# EAGLE design jkw_hdmi_v2 (EAGLE 7.6.0)
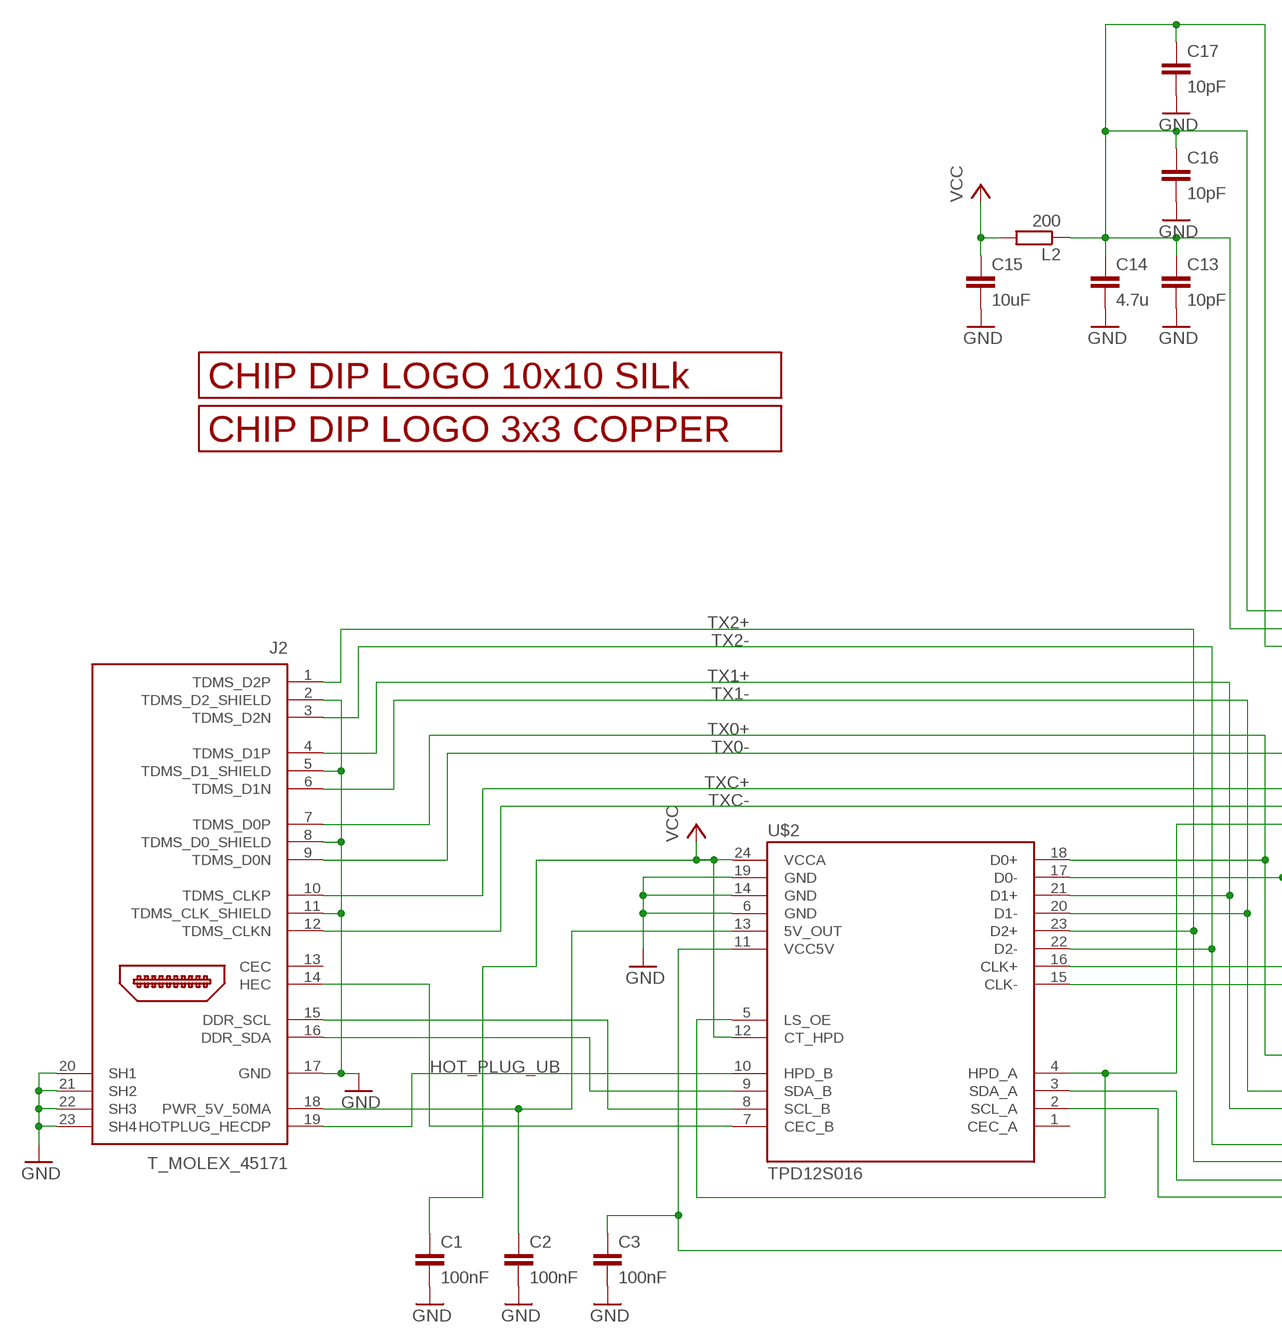
[diagram p0: schematic, sheet 1, part 1 of 2]
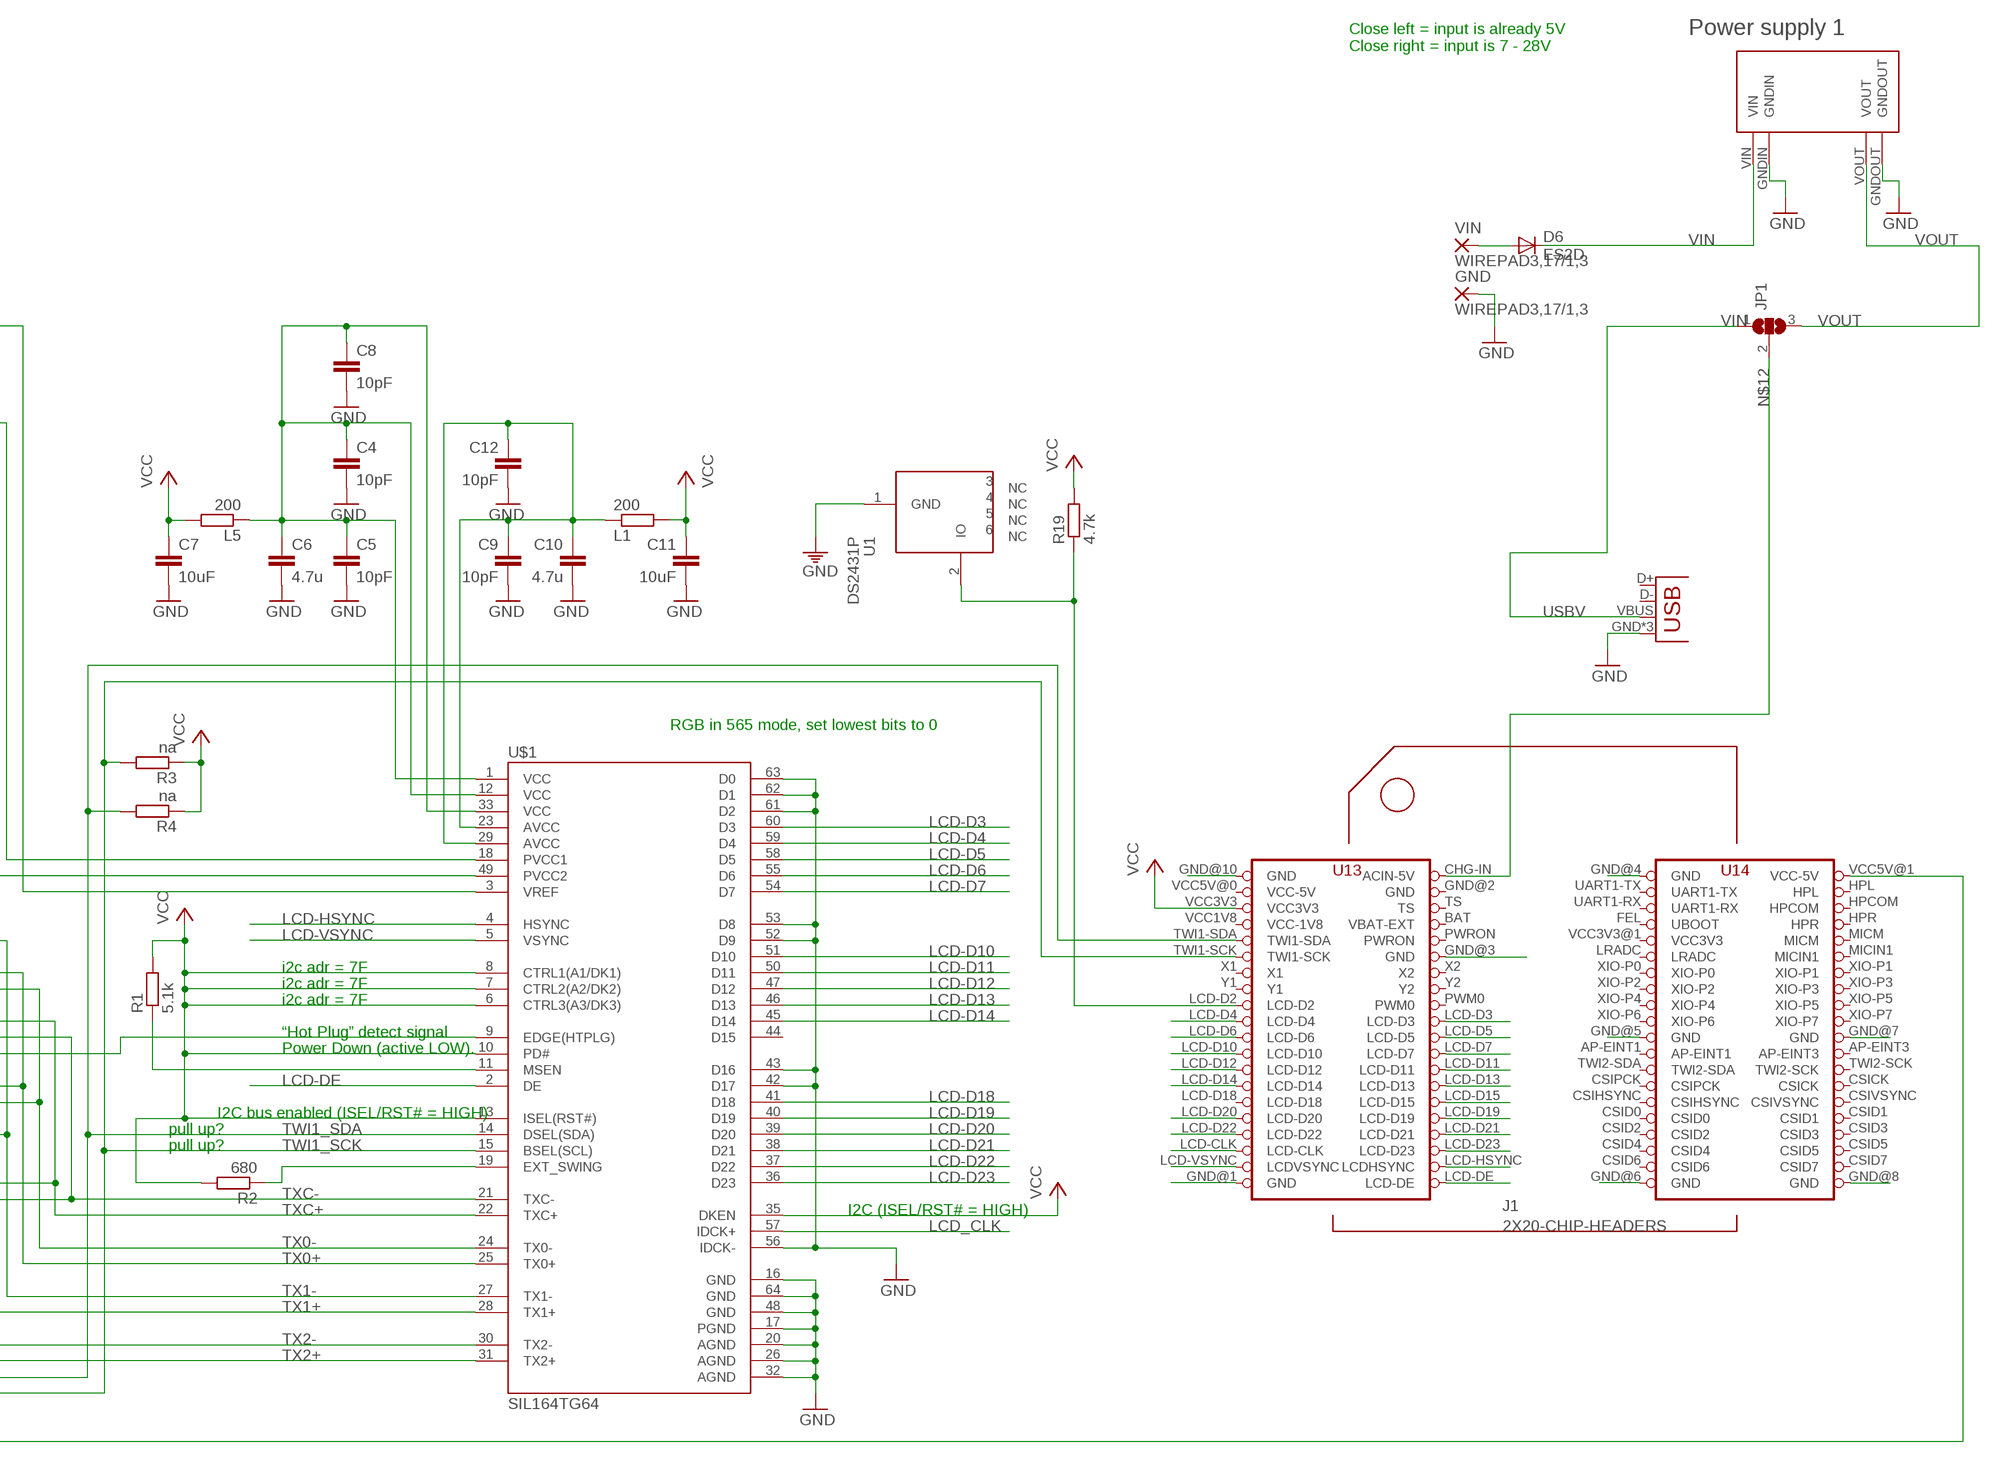
[diagram p1: schematic, sheet 1, part 2 of 2]

## Parts
C1  100nF  C-EUC0805  [C0805]
C2  100nF  C-EUC0805  [C0805]
C3  100nF  C-EUC0805  [C0805]
C4  10pF  C-EUC0805  [C0805]
C5  10pF  C-EUC0805  [C0805]
C6  4.7u  C-EUC0805  [C0805]
C7  10uF  C-EUC0805  [C0805]
C8  10pF  C-EUC0805  [C0805]
C9  10pF  C-EUC0805  [C0805]
C10  4.7u  C-EUC0805  [C0805]
C11  10uF  C-EUC0805  [C0805]
C12  10pF  C-EUC0805  [C0805]
C13  10pF  C-EUC0805  [C0805]
C14  4.7u  C-EUC0805  [C0805]
C15  10uF  C-EUC0805  [C0805]
C16  10pF  C-EUC0805  [C0805]
C17  10pF  C-EUC0805  [C0805]
D6  ES2D  [SMB]
GND  WIREPAD3,17/1,3  [3,17/1,3]
J1  2X20-CHIP-HEADERS  [2X20CHIP_SM]
J2  T_MOLEX_45171  [T_MOLEX_45171]
JP1  SJ2W  [SJ_2]
L1  200  R-EU_R0805  [R0805]
L2  200  R-EU_R0805  [R0805]
L5  200  R-EU_R0805  [R0805]
POWER_USB  USBUSB-MICROB-SMT-DIP  [USB-MICROB-SMT-DIP]
R1  5.1k  R-EU_M0805  [M0805]
R2  680  R-EU_M0805  [M0805]
R3  na  R-EU_M0805  [M0805]
R4  na  R-EU_M0805  [M0805]
R19  4.7k  R-EU_R0805  [R0805]
U1  DS2431P  [TSOC6]
U$1  SIL164TG64  [TQFP64]
U$2  TPD12S016  [DIL24]
U$3  LOGO_10X10_SILK  [LOGO_10X10_SILK]
U$4  LOGO_3X3_COPPER  [LOGO_3X3_COPPER]
U$9  MP1584EN_FRAMELESS  [MP1584EN_FRAMELESS]
VIN  WIREPAD3,17/1,3  [3,17/1,3]

## Nets
ASD: R1.1 U$1.11(MSEN)
GND: C1.2 C2.2 C3.2 C4.2 C5.2 C6.2 C7.2 C8.2 C9.2 C10.2 C11.2 C12.2 C13.2 C14.2 C15.2 C16.2 C17.2 GND.1(P) J1.GND@1(GND) J1.GND@3(GND) J1.GND@4(GND) J1.GND@5(GND) J1.GND@6(GND) J1.GND@7(GND) J1.GND@8(GND) J1.GND@10(GND) J2.2(TDMS_D2_SHIELD) J2.5(TDMS_D1_SHIELD) J2.8(TDMS_D0_SHIELD) J2.11(TDMS_CLK_SHIELD) J2.17(GND) J2.20(SH1) J2.21(SH2) J2.22(SH3) J2.23(SH4) POWER_USB.GND POWER_USB.MT1(GND) POWER_USB.MT2(GND) U1.1(GND) U$1.16(GND) U$1.17(PGND) U$1.20(AGND) U$1.26(AGND) U$1.32(AGND) U$1.42(D17) U$1.43(D16) U$1.48(GND) U$1.52(D9) U$1.53(D8) U$1.56(IDCK-) U$1.61(D2) U$1.62(D1) U$1.63(D0) U$1.64(GND) U$2.6(GND) U$2.14(GND) U$2.19(GND) U$9.GNDIN U$9.GNDOUT
HOT_PLUG_UB: J2.19(HOTPLUG_HECDP) U$2.10(HPD_B)
HOTPLUG_DET: U$1.9(EDGE(HTPLG)) U$2.4(HPD_A) U$2.5(LS_OE)
LCD-D3: J1.LCD-D3 U$1.60(D3)
LCD-D4: J1.LCD-D4 U$1.59(D4)
LCD-D5: J1.LCD-D5 U$1.58(D5)
LCD-D6: J1.LCD-D6 U$1.55(D6)
LCD-D7: J1.LCD-D7 U$1.54(D7)
LCD-D10: J1.LCD-D10 U$1.51(D10)
LCD-D11: J1.LCD-D11 U$1.50(D11)
LCD-D12: J1.LCD-D12 U$1.47(D12)
LCD-D13: J1.LCD-D13 U$1.46(D13)
LCD-D14: J1.LCD-D14 U$1.45(D14)
LCD-D15: J1.LCD-D15
LCD-D18: U$1.41(D18)
LCD-D19: J1.LCD-D19 U$1.40(D19)
LCD-D20: J1.LCD-D20 U$1.39(D20)
LCD-D21: J1.LCD-D21 U$1.38(D21)
LCD-D22: J1.LCD-D22 U$1.37(D22)
LCD-D23: J1.LCD-D23 U$1.36(D23)
LCD-DE: J1.LCD-DE U$1.2(DE)
LCD-HSYNC: J1.LCD-HSYNC(LCDHSYNC) U$1.4(HSYNC)
LCD-VSYNC: J1.LCD-VSYNC(LCDVSYNC) U$1.5(VSYNC)
LCD_CLK: J1.LCD-CLK U$1.57(IDCK+)
N$2: R2.1 U$1.19(EXT_SWING)
N$3: C2.1 J2.18(PWR_5V_50MA) U$2.13(5V_OUT)
N$4: C4.1 C5.1 C6.1 C8.1 L5.1 U$1.1(VCC) U$1.12(VCC) U$1.33(VCC)
N$5: J1.LCD-D2 R19.1 U1.2(IO)
N$6: J2.15(DDR_SCL) U$2.8(SCL_B)
N$7: J2.16(DDR_SDA) U$2.9(SDA_B)
N$8: C9.1 C10.1 C12.1 L1.1 U$1.23(AVCC) U$1.29(AVCC)
N$9: J2.14(HEC) U$2.7(CEC_B)
N$10: C13.1 C14.1 C16.1 C17.1 L2.1 U$1.3(VREF) U$1.18(PVCC1) U$1.49(PVCC2)
N$12: J1.CHG-IN(ACIN-5V) JP1.2
N$65: D6.A VIN.1(P)
TWI1_SCK: J1.TWI1-SCK R3.2 U$1.15(BSEL(SCL)) U$2.2(SCL_A)
TWI1_SDA: J1.TWI1-SDA R4.2 U$1.14(DSEL(SDA)) U$2.3(SDA_A)
TX0+: J2.7(TDMS_D0P) U$1.25(TX0+) U$2.18(D0+)
TX0-: J2.9(TDMS_D0N) U$1.24(TX0-) U$2.17(D0-)
TX1+: J2.4(TDMS_D1P) U$1.28(TX1+) U$2.21(D1+)
TX1-: J2.6(TDMS_D1N) U$1.27(TX1-) U$2.20(D1-)
TX2+: J2.1(TDMS_D2P) U$1.31(TX2+) U$2.23(D2+)
TX2-: J2.3(TDMS_D2N) U$1.30(TX2-) U$2.22(D2-)
TXC+: J2.10(TDMS_CLKP) U$1.22(TXC+) U$2.16(CLK+)
TXC-: J2.12(TDMS_CLKN) U$1.21(TXC-) U$2.15(CLK-)
USBV: JP1.1 POWER_USB.VBUS
VCC: C1.1 C7.1 C11.1 C15.1 J1.VCC3V3 L1.2 L2.2 L5.2 R1.2 R2.2 R3.1 R4.1 R19.2 U$1.6(CTRL3(A3/DK3)) U$1.7(CTRL2(A2/DK2)) U$1.8(CTRL1(A1/DK1)) U$1.10(PD#) U$1.13(ISEL(RST#)) U$1.35(DKEN) U$2.12(CT_HPD) U$2.24(VCCA)
VCC_5V_DCC: C3.1 J1.VCC5V@1(VCC-5V) U$2.11(VCC5V)
VIN: D6.C U$9.VIN
VOUT: JP1.3 U$9.VOUT
Unconnected: J1.AP-EINT1 J1.AP-EINT3 J1.BAT(VBAT-EXT) J1.CSICK J1.CSID0 J1.CSID1 J1.CSID2 J1.CSID3 J1.CSID4 J1.CSID5 J1.CSID6 J1.CSID7 J1.CSIHSYNC J1.CSIPCK J1.CSIVSYNC J1.FEL(UBOOT) J1.HPCOM J1.HPL J1.HPR J1.LCD-D18 J1.LRADC J1.MICIN1 J1.MICM J1.PWM0 J1.PWRON J1.TS J1.TWI2-SCK J1.TWI2-SDA J1.UART1-RX J1.UART1-TX J1.X1 J1.X2 J1.XIO-P0 J1.XIO-P1 J1.XIO-P2 J1.XIO-P3 J1.XIO-P4 J1.XIO-P5 J1.XIO-P6 J1.XIO-P7 J1.Y1 J1.Y2 J2.13(CEC) POWER_USB.D+ POWER_USB.D- U1.3(NC) U1.4(NC) U1.5(NC) U1.6(NC) U$2.1(CEC_A)

## Notes on the sheet
- Power supply 1
- Close left = input is already 5V
  Close right = input is 7 - 28V
- RGB in 565 mode, set lowest bits to 0
- i2c adr = 7F
- i2c adr = 7F
- i2c adr = 7F
- “Hot Plug” detect signal
- Power Down (active LOW).
- I2C bus enabled (ISEL/RST# = HIGH)
- pull up?
- pull up?
- I2C (ISEL/RST# = HIGH)

## Power pins joined to a net without a drawn wire
D15: U$1.44(D15)
GND: J1.GND@2(GND)
VCC3V3: J1.VCC3V3@1(VCC3V3)
VCC-1V8: J1.VCC1V8(VCC-1V8)
VCC-5V: J1.VCC5V@0(VCC-5V)

## Library data of the parts
C1-C17 = rcl:C-EU: CAPACITOR, European symbol
D6 = diode:ES2D: DIODE super fast rectifier, 2 A
GND VIN = wirepad:WIREPAD: Wire PAD connect wire on PCB
J1 = VGA-DIP:2X20-CHIP-HEADERS: Through hole layout with chip reference
J2 = CHIP_HDMI:T_MOLEX_45171
JP1 = jumper:SJ2W: SMD solder JUMPER
L1 L2 L5 R1-R4 R19 = rcl:R-EU_: RESISTOR, European symbol
POWER_USB = Spark:USB
U1 = VGA-DIP:DS2431: 1024-Bit EEPROM This chip provides a 4x256 Bit EEPROM, which can be programmed@5V. Write protection and OTP emulation are available, too. Author: Jan Kandziora <jjj@gmx.de>; DESCRIPTION: IC, 1024-Bit, 1-Wire EEPROM, TSOC6; FOOTPRINT: TSOC6; LINK: http://www.digikey.com/product-detail/en/DS2431P%2BT%26R/DS2431P%2BT%26RCT-ND/3647900; MFG: DIGIKEY; MFG_PN: DS2431P+T&RCT-ND; PART_TYPE: IC; PRICE: 0.98; VENDOR: MAXIM; VENDOR_PART_NUMBER: DS2431P+T&R
U$1 = SII164CTG64:SIL164TG64
U$2 = SII164CTG64:TPD12S016
U$3 = logo:LOGO_10X10_SILK
U$4 = JKW_CHIP:LOGO_3X3_COPPER
U$9 = JKW_CHIP:MP1584EN_FRAMELESS

## Board
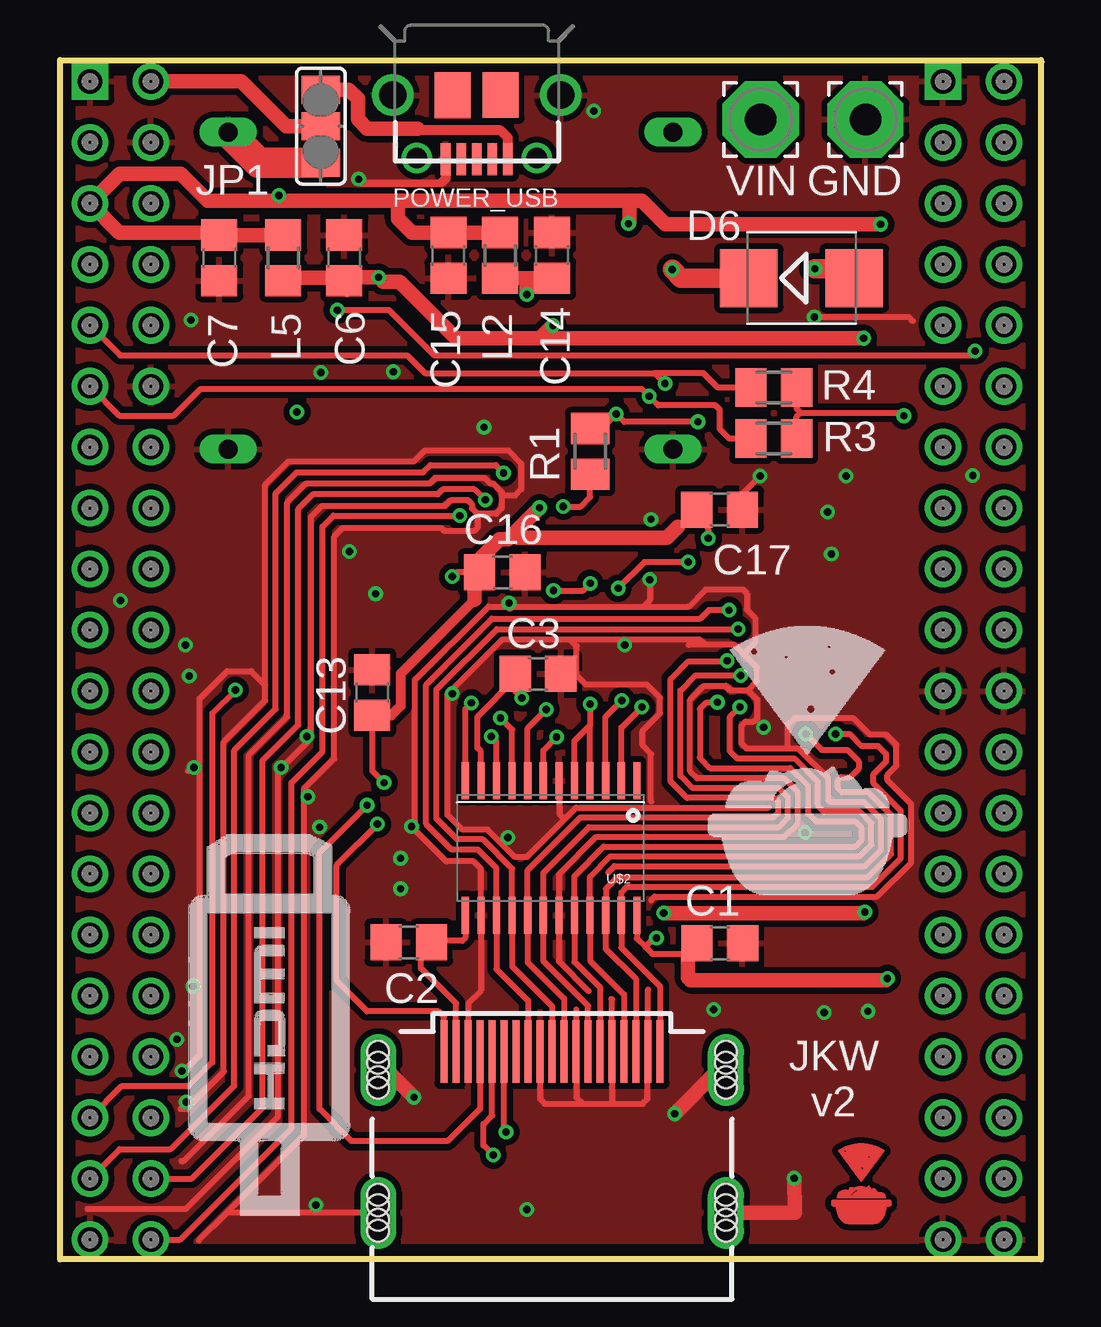
[diagram p2: board, top side]
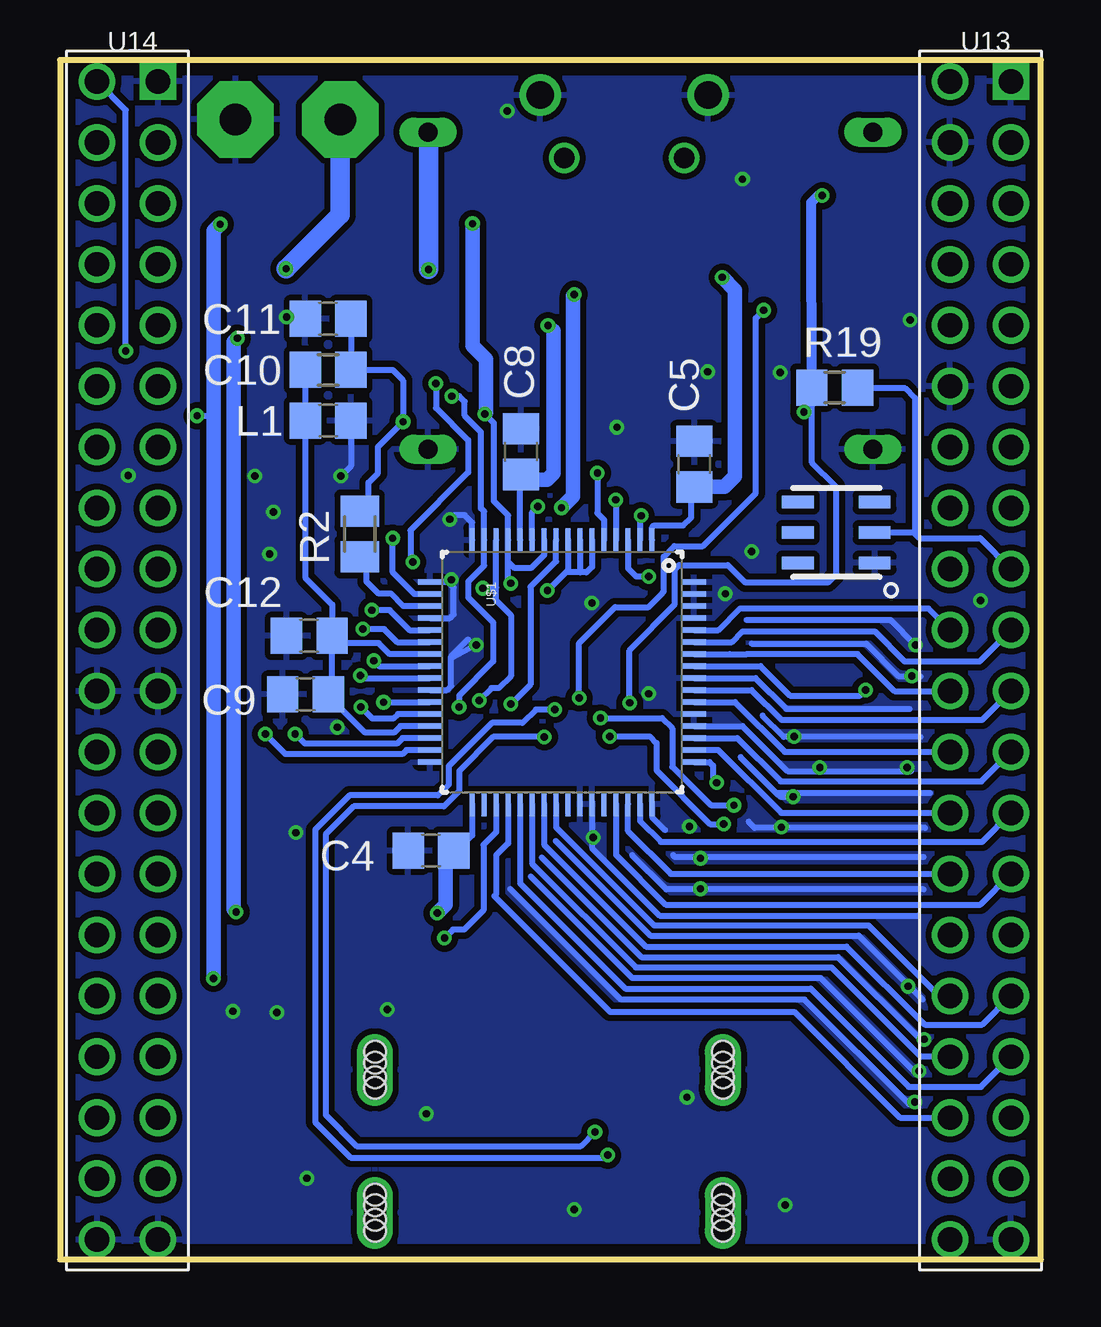
[diagram p3: board, bottom side, seen from below]

Size 40.89 x 49.97 mm. Coordinates in mm from the lower left corner, seen from the top.
Outline: 0,49.97 40.89,49.97 40.89,0 0,0 0,49.97
Copper layers (1*16): Top 0.035mm / dielectric 1.6mm / Bottom 0.035mm
Design rules "Elecrow_2-layer_PCB_eagle_rule": minimum track width 6mil, minimum drill 12mil, track to track 6mil, track to pad 6mil, pad to pad 6mil, via to via 8mil, smd to smd 0mil, copper to edge 20mil, drill to drill 10mil, minimum pad ring 6mil, minimum via ring 6mil, stop-mask expansion 0mil, vias tented up to drill 100mil, thermal gap 10mil

### Footprints (pad centres in the part's own frame; a part is rotated, then mirrored left to right if it is on the bottom)
C0805 = smd 1.3 x 1.5: 1 -0.95,0; 2 0.95,0
SMB = smd 2.4 x 2.4: A 2.2,0; C -2.2,0
3,17/1,3 = drill 1.321 pad 3.175 octagon: 1 0,0
2X20CHIP_SM = drill 1.016: AP-EINT1 36.81,21.65; AP-EINT3 39.35,21.65; BAT 3.79,41.97; CHG-IN 3.79,49.59; CSICK 39.35,16.57; CSID0 36.81,11.49; CSID1 39.35,11.49; CSID2 36.81,8.95; CSID3 39.35,8.95; CSID4 36.81,6.41; CSID5 39.35,6.41; CSID6 36.81,3.87; CSID7 39.35,3.87; CSIHSYNC 36.81,14.03; CSIPCK 36.81,16.57; CSIVSYNC 39.35,14.03; FEL 36.81,41.97; GND@1 3.79,36.89; GND@2 1.25,1.33; GND@4 39.35,24.19; GND@5 39.35,1.33; GND@6 36.81,1.33; GND@7 36.81,24.19; GND@10 3.79,47.05; HPCOM 39.35,44.51; HPL 39.35,47.05; HPR 39.35,41.97; LCD-CLK 1.25,6.41; LCD-D2 1.25,29.27; LCD-D3 3.79,26.73; LCD-D4 1.25,26.73; LCD-D5 3.79,24.19; LCD-D6 1.25,24.19; LCD-D7 3.79,21.65; LCD-D10 1.25,21.65; LCD-D11 3.79,19.11; LCD-D12 1.25,19.11; LCD-D13 3.79,16.57; LCD-D14 1.25,16.57; LCD-D15 3.79,14.03; LCD-D18 1.25,14.03; LCD-D19 3.79,11.49; LCD-D20 1.25,11.49; LCD-D21 3.79,8.95; LCD-D22 1.25,8.95; LCD-D23 3.79,6.41; LCD-DE 3.79,1.33; LCD-HSYNC 3.79,3.87; LCD-VSYNC 1.25,3.87; LRADC 36.81,36.89; MICIN1 39.35,36.89; MICM 39.35,39.43; PWM0 3.79,29.27; PWRON 3.79,39.43; TS 3.79,44.51; TWI1-SCK 1.25,36.89; TWI1-SDA 1.25,39.43; TWI2-SCK 39.35,19.11; TWI2-SDA 36.81,19.11; UART1-RX 36.81,44.51; UART1-TX 36.81,47.05; VCC1V8 1.25,41.97; VCC3V3 1.25,44.51; VCC3V3@1 36.81,39.43; VCC5V@0 1.25,47.05; VCC5V@1 39.35,49.59; X1 1.25,34.35; X2 3.79,34.35; XIO-P0 36.81,34.35; XIO-P1 39.35,34.35; XIO-P2 36.81,31.81; XIO-P3 39.35,31.81; XIO-P4 36.81,29.27; XIO-P5 39.35,29.27; XIO-P6 36.81,26.73; XIO-P7 39.35,26.73; Y1 1.25,31.81; Y2 3.79,31.81 | drill 1.016 square: GND@3 1.25,49.59; GND@8 36.81,49.59
T_MOLEX_45171 = smd 0.3 x 2.6: 1 4.5,10.31; 2 4,10.31; 3 3.5,10.31; 4 3,10.31; 5 2.5,10.31; 6 2,10.31; 7 1.5,10.31; 8 1,10.31; 9 0.5,10.31; 10 0,10.31; 11 -0.5,10.31; 12 -1,10.31; 13 -1.5,10.31; 14 -2,10.31; 15 -2.5,10.31; 16 -3,10.31; 17 -3.5,10.31; 18 -4,10.31; 19 -4.5,10.31 | drill 0.9 pad 1.499 long: 20 -7.25,3.59; 21 7.25,3.59; 22 7.25,9.55; 23 -7.25,9.55 | hole 0.9: -7.25,10.3; -7.25,8.8; -7.25,9.85; -7.25,9.25; -7.25,4.35; -7.25,2.85; -7.25,3.9; -7.25,3.3; 7.25,10.3; 7.25,8.8; 7.25,9.85; 7.25,9.25; 7.25,4.35; 7.25,3.9; 7.25,2.85; 7.25,3.3
SJ_2 = smd 1.168 x 1.6: 1 -1.524,0; 2 0,0; 3 1.524,0
R0805 = smd 1.3 x 1.5: 1 -0.95,0; 2 0.95,0
USB-MICROB-SMT-DIP = smd 0.4 x 1.35: D+ 0,2.675; D- -0.65,2.675; GND 1.3,2.675; ID 0.65,2.675; VBUS -1.3,2.675 | drill 1.15 pad 1.7: MT1 -3.5,0; MT2 3.5,0 | drill 0.85 pad 1.25: MT3 -2.5,2.625; MT4 2.5,2.625 | smd 1.5 x 1.9: P$1 -1,0; P$2 1,0.01
M0805 = smd 1.3 x 1.6: 1 -0.95,0; 2 0.95,0
TSOC6 = smd 0.53 x 1.33: 1 -1.27,-1.6; 2 0,-1.6; 3 1.27,-1.6; 4 1.27,1.6; 5 0,1.6; 6 -1.27,1.6
TQFP64 = smd 1 x 0.22: 1 -5.5,3.75; 2 -5.5,3.25; 3 -5.5,2.75; 4 -5.5,2.25; 5 -5.5,1.75; 6 -5.5,1.25; 7 -5.5,0.75; 8 -5.5,0.25; 9 -5.5,-0.25; 10 -5.5,-0.75; 11 -5.5,-1.25; 12 -5.5,-1.75; 13 -5.5,-2.25; 14 -5.5,-2.75; 15 -5.5,-3.25; 16 -5.5,-3.75; 33 5.5,-3.75; 34 5.5,-3.25; 35 5.5,-2.75; 36 5.5,-2.25; 37 5.5,-1.75; 38 5.5,-1.25; 39 5.5,-0.75; 40 5.5,-0.25; 41 5.5,0.25; 42 5.5,0.75; 43 5.5,1.25; 44 5.5,1.75; 45 5.5,2.25; 46 5.5,2.75; 47 5.5,3.25; 48 5.5,3.75 | smd 0.22 x 1: 17 -3.75,-5.5; 18 -3.25,-5.5; 19 -2.75,-5.5; 20 -2.25,-5.5; 21 -1.75,-5.5; 22 -1.25,-5.5; 23 -0.75,-5.5; 24 -0.25,-5.5; 25 0.25,-5.5; 26 0.75,-5.5; 27 1.25,-5.5; 28 1.75,-5.5; 29 2.25,-5.5; 30 2.75,-5.5; 31 3.25,-5.5; 32 3.75,-5.5; 49 3.75,5.5; 50 3.25,5.5; 51 2.75,5.5; 52 2.25,5.5; 53 1.75,5.5; 54 1.25,5.5; 55 0.75,5.5; 56 0.25,5.5; 57 -0.25,5.5; 58 -0.75,5.5; 59 -1.25,5.5; 60 -1.75,5.5; 61 -2.25,5.5; 62 -2.75,5.5; 63 -3.25,5.5; 64 -3.75,5.5
DIL24 = smd 0.3 x 1.55: 1 -3.6,-2.8; 2 -2.95,-2.8; 3 -2.3,-2.8; 4 -1.65,-2.8; 5 -1,-2.8; 6 -0.35,-2.8; 7 0.3,-2.8; 8 0.95,-2.8; 9 1.6,-2.8; 10 2.25,-2.8; 11 2.9,-2.8; 12 3.55,-2.8; 13 3.55,2.8; 14 2.9,2.8; 15 2.25,2.8; 16 1.6,2.8; 17 0.95,2.8; 18 0.3,2.8; 19 -0.35,2.8; 20 -1,2.8; 21 -1.65,2.8; 22 -2.3,2.8; 23 -2.95,2.8; 24 -3.6,2.8
MP1584EN_FRAMELESS = drill 0.8 long: GNDIN 1.778,14.986; GNDOUT 20.32,14.986; VIN 1.778,1.778; VOUT 20.32,1.778

### Placement (x,y rotation side)
C1  27.51,13.17 0 top
C2  14.54,13.21 180 top
C3  19.93,24.4 0 top
C4  25.43,17.03 180 bottom
C5  14.45,33.13 90 bottom
C6  11.85,41.73 90 top
C7  6.64,41.73 270 top
C8  21.68,33.66 90 bottom
C9  30.66,23.55 180 bottom
C10  29.72,34.95 0 bottom
C11  29.72,39.19 180 bottom
C12  30.51,25.98 180 bottom
C13  13.02,23.62 90 top
C14  20.51,41.83 90 top
C15  16.19,41.83 270 top
C16  18.44,28.63 0 top
C17  27.5,31.24 0 top
D6  30.91,40.88 0 top
GND  33.58,47.5 180 top
J1  0,-0.51 0 top
J2  20.51,-1.65 0 top
JP1  10.87,47.22 270 top
L1  29.72,37.06 0 bottom
L2  18.35,41.83 90 top
L5  9.31,41.73 90 top
POWER_USB  17.37,48.51 180 top
R1  22.1,33.67 90 top
R2  28.4,30.23 90 bottom
R3  29.76,34.2 180 top
R4  29.76,36.32 180 top
R19  8.6,36.32 180 bottom
U1  8.53,30.29 90 bottom
U$1  19.96,24.47 270 bottom
U$2  20.45,17.15 180 top
U$3  26.99,15.15 0 top
U$4  33.4,3.15 0 top
U$9  27.33,48.74 180 top
VIN  29.21,47.5 180 top

### Tracks (layer width: path | path; a pad name or v marks a point on that pad's centre or on a via)
ASD  (via drill 0.3)
  Top 0.254: 22.17,32.39 R1.1 22.1,31.78 21.69,31.37 v20.98,31.37
  Bottom 0.254: U$1.11 21.21,31.14 v20.98,31.37
GND  (via drill 0.3)
  Top 0.254: 24.51,11.24 J2.2 24.49,8.63 24.49,6.68 24.28,6.48 22.96,6.48 | J2.8 21.53,8.68 | 21.53,8.68 21.53,10.41 | 22.99,10.86 23.01,10.84 J2.5 23.01,6.53 22.96,6.48 | 22.04,11.18 20.8,12.41 U$2.19 20.8,16.05 22.35,17.6 30.2,17.6 30.76,18.16 30.76,19.48 30.2,20.04 26.57,20.04 26.26,20.34 26.26,23.32 26.85,23.9 27.74,23.9 | U$2.6 20.83,19.91 20.83,18.54 21.03,18.34 | 27.94,8.08 J2.22 | J2.17 17.02,10.67 17.55,11.2 U$2.14 17.55,16.29 17.25,16.59 16.1,16.59 14.81,17.88 14.81,24.16 17.86,27.2 18.75,27.2 24.33,27.2 | 28.68,23.72 29.08,23.32 29.08,22.55 28.93,22.4 28.58,22.4 28.4,22.23 28.4,21.51 28.63,21.29 30.33,21.29 | 27.97,23.72 27.79,23.9 27.74,23.9 | 27.74,23.9 27.91,23.72 27.97,23.72 | 27.97,23.72 28.68,23.72 | 28.68,23.72 29.06,24.1 29.06,24.66 28.49,25.23 | 26.21,25.6 28.12,25.6 28.49,25.23 | 21.03,18.34 21.51,18.82 29.54,18.82 | 21.03,18.34 19.46,16.76 18.97,16.76 17.83,17.91 16.77,17.91 16.15,18.53 16.15,23.55 18.44,25.83 26.67,25.83 26.85,25.65 26.85,25.68 | 24.33,27.2 26.21,27.2 26.92,27.91 28.47,27.91 28.63,27.76 28.63,27.08 28.98,26.72 28.98,25.73 28.49,25.23 | J2.20 6.94,1.94 | 6.94,1.94 5.79,0.79 | 6.94,1.94 10.18,5.18 10.18,19.61 11.43,20.85 11.43,30.12 11.79,30.48 15.88,30.48 16,30.35 17.27,30.35 17.4,30.48 17.4,31.06 | 5.03,6.27 5.28,6.27 6.83,7.82 6.83,21.56 8.56,23.29 8.56,23.93 | 8.56,23.93 8.56,32.28 9.52,33.25 14.76,33.25 15.21,33.71 18.69,33.71 19.23,33.17 19.23,32.08 18.97,31.83 18.41,31.83 | 4.93,7.95 5.26,7.95 5.82,8.51 5.82,23.37 6.96,24.51 7.98,24.51 8.56,23.93 | 5.05,4.09 5.16,4.09 7.87,6.81 7.87,21.01 9.47,22.61 9.47,31.55 10.26,32.33 15.42,32.33 15.65,32.56 17.7,32.56 17.93,32.33 18.06,32.33 18.41,31.98 18.41,31.83
  Top 0.254: 1.14,2.11 5.26,2.11 9.09,5.94 9.09,20.34 10.46,21.72 10.46,30.94 10.92,31.39 16.05,31.39 16.31,31.65 16.99,31.65 17.17,31.47 17.17,31.29 17.4,31.06 | J2.11 20.01,6.69 20.22,6.48 21.79,6.48 | 21.79,6.48 22.96,6.48 | 21.53,8.68 21.53,6.74 21.79,6.48 | 22.86,16.13 23.11,16.38 33.55,16.38 34.24,17.07 34.24,18.34 33.53,19.05 32.11,19.05 32.03,19.13 32.03,20.04 30.79,21.29 30.33,21.29 | 24.64,14.96 24.79,15.11 34.06,15.11 35.48,16.54 35.48,18.97 34.49,19.96 34.49,20.19 34.87,20.57 34.87,21.44 34.44,21.87 33.76,21.87 33.07,22.55 30.61,22.55 30.33,22.28 30.33,21.29 | 18.41,31.83 18.41,31.29 18.19,31.06 17.4,31.06 | v24.64,30.84 24.64,30.79 24.74,30.68 | v31.45,39.27 35.38,39.27 35.56,39.09 | v24.59,28.32 24.59,27.46 24.33,27.2 | v5.59,20.5 5.59,20.34 5.33,20.34 | 24.64,19.08 24.64,21.06 24.28,21.41 24.28,22.02 25.02,22.76 25.02,23.39 24.46,23.95 21.92,23.95 21.54,24.33 21.54,25.55 21.31,25.78 21.34,25.78 21.36,25.81 | C17.2 28.45,31.9 v29.19,32.64
  Top 0.305: 15.95,44.91 15.88,44.83 12.62,44.83 v12.45,45.01
  Top 0.406: v18.72,27.36 18.75,27.33 18.75,27.2 | POWER_USB.GND 16.07,45.03 15.95,44.91
  Top 0.61: J2.21 30.64,1.94 v30.61,3.38 | J2.23 13.62,7.9 v14.76,6.76 | J2.22 27.46,7.9 v25.63,6.07
  Bottom 0.254: U$1.48 16.21,18.42 15.67,17.88 | U$1.43 18.71,17.14 15.9,14.33 5.13,14.33 | U$1.52 12.44,22.22 10.57,20.34 5.44,20.34 | U$1.56 11.9,24.22 10.62,22.94 5.49,22.94 | 5.03,21.77 10.72,21.77 11.61,22.66 | U$1.16 23.71,30.7 24.03,31.01 24.46,31.01 v24.64,30.84 | U$1.20 24.64,26.72 24.49,26.87 24.49,27.99 24.72,28.22 | 24.72,28.22 U$1.17 | C11.2 31.37,39.19 v31.45,39.27 | 24.72,28.22 24.69,28.22 v24.59,28.32 | U$1.26 24.77,23.72 24.59,23.9 24.59,25.04 | 24.59,25.04 v23.55,25.6 | 5.18,6.48 5.51,6.48 9.86,10.82 17.5,10.82 22.12,15.44 | 4.93,7.8 5.26,7.8 9.2,11.74 17.04,11.74 21.26,15.95 | 20.8,16.74 16.66,12.6 8.46,12.6 5.03,9.17 v4.88,9.17 | 20.22,17.42 16.28,13.49 7.59,13.49 5.49,11.38 | 4.93,10.82 5.49,11.38 | 5.49,11.38 v5.54,11.38 | 4.9,15.42 15.62,15.42 17.04,16.84 | 4.9,16.76 15.27,16.76 15.34,16.84 | 4.83,17.98 11.94,17.98 12.19,18.24 | 4.62,19.43 11.02,19.43 | 11.02,19.43 12.52,20.93 | 11.02,19.43 10.87,19.28 v10.34,19.28 | 12.07,25.65 7.29,25.65 5.94,24.31 5.05,24.31 5.03,24.28 | 12.27,26.65 6.27,26.65 5.21,25.58 | 24.59,25.04 24.59,25.12 23.88,25.83 | 5.41,20.34 5.44,20.34 | 5.44,20.34 v5.59,20.5 | C10.2 28.77,33.06 v29.19,32.64
  other vias: 5.46,39.14 22.25,47.85 12.07,29.49 2.51,27.46 18.67,17.58 14.66,18.03 9.22,20.5 10.29,21.79 13.16,27.74 16.36,23.57 32,31.14 32.16,29.39 32.77,32.64 38.05,32.66 17.68,34.67 13.89,36.98 10.87,36.96 31.85,10.29 33.68,10.34 19.46,2.08 10.67,2.26 5.08,7.85 5.26,6.55 14.2,15.44 14.2,16.71 10.82,18.01 5.38,24.31 5.23,25.6 31.06,17.78 29.34,22.17 27.25,10.41
  pour Top (isolate 0.254): 0.13,0 40.89,0 40.89,50 0.13,50
  pour Bottom (isolate 0.254): 0.13,0 40.89,0 40.89,50 0.13,50
HOT_PLUG_UB  (via drill 0.3)
  Top 0.254: U$2.10 18.2,21.58 v17.98,21.79 | v13.23,18.14 11.53,16.43 11.53,11.61 12.8,10.34 15.77,10.34 16.01,10.1 J2.19
  Bottom 0.254: v17.98,21.79 16.31,21.79 16.03,21.51 16.03,20.37 13.79,18.14 v13.23,18.14
HOTPLUG_DET  (via drill 0.3)
  Top 0.254: U$2.4 22.1,22.25 | U$2.5 21.45,21.6 22.1,22.25 | v22.1,23.14 22.1,22.25
  Bottom 0.254: U$1.9 20.21,29.09 21.29,28.02 21.29,23.95 v22.1,23.14
LCD-D3
  Bottom 0.254: U$1.60 13.45,26.22 12.55,27.13 4.7,27.13 J1.LCD-D3
LCD-D4
  Bottom 0.254: U$1.59 12.89,25.72 12.45,26.16 6.93,26.16 5.69,24.92 2.55,24.92 J1.LCD-D4
LCD-D5
  Bottom 0.254: U$1.58 12.98,25.22 12.27,25.22 7.65,25.22 6.11,23.68 J1.LCD-D5
LCD-D6
  Bottom 0.254: U$1.55 12.06,23.72 10.82,22.48 2.45,22.48 J1.LCD-D6
LCD-D7
  Bottom 0.254: U$1.54 12.76,23.22 10.68,21.14 J1.LCD-D7
LCD-D10
  Bottom 0.254: U$1.51 12.66,21.72 10.85,19.91 2.48,19.91 J1.LCD-D10
LCD-D11
  Bottom 0.254: U$1.50 13.45,21.22 10.83,18.6 J1.LCD-D11
LCD-D12
  Bottom 0.254: U$1.47 16.71,18.26 15.85,17.4 2.45,17.4 J1.LCD-D12
LCD-D13
  Bottom 0.254: J1.LCD-D13 15.43,16.06 17.21,17.85 U$1.46
LCD-D14
  Bottom 0.254: U$1.45 17.71,16.85 15.65,14.78 2.53,14.78 J1.LCD-D14
LCD-D19
  Bottom 0.254: U$1.40 20.21,18.01 16.13,13.92 7.19,13.92 4.25,10.98 J1.LCD-D19
LCD-D20
  Bottom 0.254: U$1.39 20.71,17.29 16.46,13.03 8.1,13.03 4.85,9.78 2.45,9.78 J1.LCD-D20
LCD-D21
  Bottom 0.254: U$1.38 21.21,16.49 16.89,12.17 8.74,12.17 5.01,8.44 J1.LCD-D21
LCD-D22
  Bottom 0.254: U$1.37 21.71,15.67 17.32,11.28 9.6,11.28 5.51,7.19 2.5,7.19 J1.LCD-D22
LCD-D23
  Bottom 0.254: U$1.36 22.21,17.33 22.71,16.84 22.71,15.22 22.78,15.14 17.96,10.31 10.29,10.31 5.88,5.9 J1.LCD-D23
LCD-DE  (via drill 0.3)
  Top 0.254: J1.LCD-DE 5.01,0.82 9.65,5.46 9.65,19.86 10.95,21.16 10.95,30.53 11.41,30.99 v16.66,30.99
  Bottom 0.254: v16.66,30.99 16.71,30.94 U$1.2
LCD-HSYNC  (via drill 0.3)
  Top 0.254: J1.LCD-HSYNC 5.5,3.36 8.46,6.33 8.46,20.8 9.93,22.28 9.93,31.27 10.54,31.88 15.75,31.88 15.95,32.08 17.27,32.08 v17.73,31.65
  Bottom 0.254: v17.73,31.65 17.71,31.35 U$1.4
LCD-VSYNC  (via drill 0.3)
  Top 0.254: J1.LCD-VSYNC 2.48,4.6 4.62,4.6 7.26,7.24 7.26,21.21 8.99,22.94 8.99,31.93 9.86,32.79 15.14,32.79 15.44,33.1 18.16,33.1 v18.49,32.77
  Bottom 0.254: v18.49,32.77 18.49,31.09 18.21,30.81 U$1.5
LCD_CLK  (via drill 0.3)
  Top 0.254: J1.LCD-CLK 2.56,7.21 5.36,7.21 6.35,8.2 6.35,22.76 v7.32,23.72
  Bottom 0.254: U$1.57 11.69,24.72 10.46,23.49 7.54,23.49 v7.32,23.72
N$1
  Top 0.406: 10.82,47.19 10.82,48.57 10.87,48.62
N$2
  Bottom 0.254: U$1.19 26.59,27.22 27.1,27.74 27.61,27.74 28.12,28.25 28.12,29.15 R2.1
N$3
  Top 0.254: U$2.13 16.9,13.4 16.76,13.27 15.5,13.27 C2.1 15.05,13.21 15.05,12.13 16.51,10.67 J2.18
N$4  (via drill 0.3)
  Top 0.254: 9.44,40.91 L5.1 | 11.72,40.91 C6.1 11.96,40.67 11.96,40.41 | 33.5,14.43 v33.55,14.48 | 13.46,40.74 v13.28,40.92
  Top 0.61: 9.44,40.91 11.72,40.91 | v25.17,14.43 33.5,14.43 | v33.5,38.38 20.02,38.38 | 20.02,38.38 16.51,38.38 14.15,40.74 13.46,40.74 | v20.55,38.91 20.02,38.38 | 11.96,40.41 12.47,40.92 v13.28,40.92
  Bottom 0.254: U$1.1 16.21,30.5 16.13,30.58 14.91,30.58 14.58,30.91 14.58,32.06 C5.1 | U$1.33 23.71,17.66 24.82,16.56 24.82,16.69 C4.1 | C8.1 21.71,32.41 U$1.12 21.71,32.36 21.59,32.49 | 33.66,14.58 v33.55,14.48 | 20.32,38.68 v20.55,38.91
  Bottom 0.61: C5.1 13.21,32.18 12.75,32.64 12.75,40.39 v13.28,40.92 | 21.59,32.49 20.6,32.49 20.32,32.77 20.32,38.68 | 24.82,16.56 24.82,14.78 v25.17,14.43 | 33.66,14.58 33.66,38.23 v33.5,38.38
N$5
  Bottom 0.254: U1.2 5.32,30.29 5.26,30.23 | J1.LCD-D2 2.54,30.05 5.08,30.05 5.26,30.23 | 5.26,30.23 5.26,35.89 5.66,36.3 7.62,36.3 R19.1
N$6  (via drill 0.3)
  Top 0.254: U$2.8 19.5,22.14 v20.27,22.91 | v18.06,4.34 17.65,4.75 17.65,5.64 18.01,6 J2.15
  Bottom 0.254: v20.27,22.91 21.06,22.91 21.62,22.35 22.88,22.35 24.69,20.55 24.69,19.79 25.15,19.33 28.83,19.33 30.25,17.91 30.25,5.71 28.78,4.24 18.16,4.24 v18.06,4.34
N$7  (via drill 0.3)
  Top 0.254: U$2.9 18.85,22.07 v18.36,22.55 | v12.8,18.92 10.82,16.94 10.82,6.27 12.17,4.93 16.15,4.93 17.51,6.28 J2.16
  Bottom 0.254: v18.36,22.55 15.8,22.55 15.37,22.12 15.37,20.52 13.77,18.92 v12.8,18.92
N$8
  Bottom 0.254: U$1.23 27.15,25.22 27.61,25.68 29.25,25.68 C12.1 | U$1.29 26.7,22.22 26.98,21.95 28.17,21.95 29.71,23.48 C9.1 29.55,23.7 C12.1 | C12.1 29.85,25.69 29.87,25.71 | L1.1 C10.1 30.67,28.41 29.54,27.28 29.54,26 C12.1
N$9  (via drill 0.3)
  Top 0.254: U$2.7 20.15,21.21 v20.7,21.77 | v18.59,5.31 18.51,5.39 J2.14
  Bottom 0.254: v18.59,5.31 19.18,4.72 28.52,4.72 29.82,6.02 29.82,17.7 28.65,18.87 24.89,18.87 24.26,19.51 24.26,20.34 22.84,21.77 v20.7,21.77
N$10  (via drill 0.3)
  Top 0.254: C13.1 13.02,20.36 v13.51,19.86 | C16.1 16.54,28.63 v16.36,28.45 | 17.27,28.41 C16.1 | C16.1 17.49,29.17 | 18.67,30 18.91,30.24 19.07,30.07 | v27.03,30.05 27.03,30.41 C17.1 25.78,30.53 25.76,30.53
  Top 0.406: 17.27,27.48 14.2,24.41 14.2,23.06 13.81,22.67 C13.1
  Top 0.61: C14.1 19.46,40.88 | 19.46,40.88 L2.1 | 17.27,27.48 17.27,28.41 | 17.49,29.17 18.31,30 18.67,30 | 18.91,30.24 v19.99,31.32 | v19.46,40.21 19.46,40.88 | 19.07,30.07 25.3,30.07 25.76,30.53 | 13.11,22.58 C13.1
  Bottom 0.254: U$1.3 17.21,28.8 16.87,28.45 v16.36,28.45 | 13.56,19.86 v13.51,19.86 13.66,20.02 13.66,20.57 13.81,20.72 U$1.49 | U$1.18 26.12,27.72 27.03,28.63 v27.03,30.05
  Bottom 0.61: v19.99,31.32 19.51,31.8 19.51,40.16 v19.46,40.21
N$12
  Top 0.61: J1.CHG-IN 7.56,49.08 9.42,47.22 JP1.2
N$65  (via drill 0.3)
  Top 0.813: v31.47,41.28 32.58,41.28 D6.A
  Bottom 0.813: VIN.1 29.21,43.54 v31.47,41.28
TWI1_SCK  (via drill 0.3)
  Top 0.254: U$2.2 23.4,22.15 v24.26,23.01 | J1.TWI1-SCK 2.48,35.15 4.75,35.15 5.87,36.27 24.26,36.27 v24.56,35.97 24.94,35.59 27.33,35.59 27.51,35.41 27.51,34.59 27.9,34.2 R3.2
  Bottom 0.254: 24.23,23.04 v24.26,23.01 24.26,23.49 22.84,24.92 22.84,26.54 23.88,27.58 23.88,28.25 23.21,28.91 U$1.15 23.21,31.16 23.34,31.29 23.34,34.47 24.03,35.15 24.03,35.74 24.26,35.97 v24.56,35.97
TWI1_SDA  (via drill 0.3)
  Top 0.254: U$2.3 22.75,22.62 v23.42,23.29 | J1.TWI1-SDA 2.5,37.67 14.48,37.67 15.21,36.93 24.79,36.93 | v26.19,29.06 24.36,29.06 v23.27,27.97 | 24.79,36.93 v25.22,36.5 | 24.79,36.93 26.82,36.93 27.43,36.32 R4.2
  Bottom 0.254: 22.71,27.99 22.71,27.46 22.1,26.85 22.1,24.31 22.61,23.8 22.91,23.8 v23.42,23.29 | 22.71,27.99 U$1.14 | v26.19,29.06 26.29,29.16 26.29,30.38 23.88,32.79 23.88,34.14 25.22,35.48 v25.22,36.5 | v23.27,27.97 22.74,27.97 22.71,27.99
TX0+  (via drill 0.3)
  Top 0.254: J2.7 22.01,10.56 20.15,12.43 U$2.18 20.15,16.11 22.05,18.01 29.97,18.01 30.35,18.41 30.35,19.25 29.97,19.63 26.37,19.63 25.86,20.14 25.86,23.7 26.49,24.33 v28.37,24.33
  Bottom 0.254: v28.37,24.33 28.26,24.22 U$1.25
TX0-  (via drill 0.3)
  Top 0.254: J2.9 21.01,10.87 19.5,12.38 U$2.17 19.5,16.22 21.69,18.41 29.74,18.41 29.95,18.62 29.95,19.08 29.79,19.23 26.14,19.23 25.45,19.91 25.45,24.18 26.19,24.92 27.71,24.92 v27.81,24.94
  Bottom 0.254: v27.81,24.94 27.59,24.72 U$1.24
TX1+  (via drill 0.3)
  Top 0.254: J2.4 23.51,11.03 22.1,12.45 U$2.21 22.1,15.95 22.94,16.79 33.33,16.79 33.83,17.3 33.83,18.16 33.35,18.64 31.85,18.64 31.6,18.9 31.6,19.89 30.61,20.88 28.22,20.88 27.91,21.18 27.91,22.58 v28.35,23.01
  Bottom 0.254: 28.06,22.72 v28.35,23.01 27.86,22.53 27,22.53 26.81,22.72 U$1.28
TX1-  (via drill 0.3)
  Top 0.254: 22.54,8.69 J2.6 22.51,11.34 21.45,12.4 U$2.20 21.45,15.96 22.66,17.2 33.15,17.2 33.43,17.48 33.43,17.98 33.17,18.24 31.52,18.24 31.19,18.57 31.19,19.71 30.43,20.47 27.1,20.47 26.67,20.9 26.67,22.94 26.92,23.19 27.38,23.19 v27.41,23.22
  Bottom 0.254: v27.41,23.22 25.47,23.22 U$1.27
TX2+  (via drill 0.3)
  Top 0.254: J2.1 25.01,11.38 23.4,12.99 U$2.23 23.4,15.29 23.62,15.52 33.86,15.52 35.05,16.71 35.05,18.69 33.91,19.84 33.91,20.22 34.44,20.75 34.44,21.06 34.11,21.39 33.43,21.39 32.92,21.9 v32.33,21.9
  Bottom 0.254: U$1.31 26.45,21.22 26.62,21.06 31.5,21.06 v32.33,21.9
TX2-  (via drill 0.3)
  Top 0.254: J2.3 24,11.68 22.75,12.94 U$2.22 22.76,14.36 22.76,15.44 23.24,15.93 33.68,15.93 34.65,16.89 34.65,18.52 33.71,19.46 32.61,19.46 32.44,19.63 32.44,19.96 32.56,20.09 32.94,20.09 33.3,20.45 33.3,20.75 32.82,21.23 31.75,21.23 v31.09,21.9
  Bottom 0.254: U$1.30 26.61,21.72 26.85,21.49 30.68,21.49 v31.09,21.9
TXC+  (via drill 0.3)
  Top 0.254: J2.10 20.51,10.54 18.85,12.21 U$2.16 18.85,16.28 17.63,17.5 16.56,17.5 15.7,18.36 15.7,23.75 18.21,26.26 v28.27,26.26
  Bottom 0.254: U$1.22 26.84,25.72 27.38,26.26 v28.27,26.26
TXC-  (via drill 0.3)
  Top 0.254: J2.12 19.51,10.78 18.2,12.09 U$2.15 18.2,16.3 17.42,17.07 16.33,17.07 15.27,18.14 15.27,23.95 18.01,26.7 26.7,26.7 27.05,27.05 v27.89,27.05
  Bottom 0.254: U$1.21 26.33,26.22 27.15,27.05 v27.89,27.05
USBV
  Top 0.406: POWER_USB.VBUS 18.67,46.73 18.36,47.04 14.99,47.04 14.91,47.12
  Top 0.61: JP1.1 12.04,48.74 12.42,48.36 12.42,47.5 12.8,47.12 14.91,47.12
VCC  (via drill 0.3)
  Top 0.254: C7.1 6.58,42.68 | L2.2 C15.1 | U$2.12 16.9,22.94 v17.14,23.19 | U$2.24 24.05,13.37 24.4,13.02 | 24.4,13.02 24.69,12.72 26.11,12.72 | 34.42,11.63 v34.49,11.71 | 26.11,12.72 C1.1 | 26.29,11.63 26.19,11.74 | 26.19,12.65 26.11,12.72 | v20.57,27.86 21.79,27.86 v22.1,28.17 | v23.7,43.16 23.75,43.21 | v24.87,13.39 24.77,13.39 24.4,13.02 | v26.59,34.9 23.52,34.9 v23.19,35.23 22.58,34.62 R1.2 | R3.1 30.71,35.1 30.89,35.28 | 30.89,35.28 35.05,35.28 v35.18,35.15 | R4.1 30.71,35.46 30.89,35.28
  Top 0.406: v9.12,44.32 9.12,44.12
  Top 0.61: 26.29,11.63 34.42,11.63 | 26.19,11.74 26.19,12.65 | L2.2 14.67,42.78 14.1,43.36 14.1,44.12 | v34.21,43.13 25.25,43.13 24.26,44.12 23.77,44.12 | L5.2 C7.1 6.55,42.77 2.48,42.77 J1.VCC3V3 2.48,45.24 5.03,45.24 6.15,44.12 9.12,44.12 14.1,44.12 | 14.1,44.12 23.77,44.12 | 23.75,43.21 23.75,44.09 23.77,44.12
  Bottom 0.254: U$1.10 20.71,29.35 21.26,28.8 21.95,28.8 22.21,29.07 | 22.21,29.07 U$1.13 22.21,31 22.81,31.6 22.81,34.85 v23.19,35.23 | U$1.8 19.71,28.72 19.8,28.64 | 19.8,28.64 v20.57,27.86 | v22.1,28.17 22.21,28.29 22.21,29.07 | U$1.6 18.71,28.86 18.95,28.63 19.2,28.63 | 19.2,28.63 19.79,28.63 19.8,28.64 | U$1.7 19.21,28.64 19.2,28.63 | v17.14,23.19 17.14,25.38 15.27,27.3 15.27,28.75 15.09,28.93 13.06,28.93 12.32,28.19 8.89,28.19 8.56,28.52 8.56,32.21 9.55,33.2 9.55,35.71 9.88,35.38 v9.88,35.31 | R2.2 28.03,31.18 28.03,32.37 27.63,32.77 27.63,33.86 v26.59,34.9 26.59,36.63 27.03,37.06 L1.2 C11.1 | U$1.35 22.71,17.8 23.24,17.27 23.24,14.55 24.05,13.74 24.51,13.74 v24.87,13.39 | v35.18,35.15 34.49,35.15
  Bottom 0.406: R19.2 9.55,35.71 9.57,44.05 9.3,44.32 v9.12,44.32
  Bottom 0.61: v34.49,11.71 34.49,35.15 34.49,42.85 v34.21,43.13 | v23.7,43.16 23.7,38.08 23.14,37.52 23.14,35.28 v23.19,35.23
VCC_5V_DCC  (via drill 0.3)
  Top 0.254: U$2.11 17.55,21.16 17.4,21.31 17.4,22.61 18.98,24.18 C3.1 18.98,23.67 v19.25,23.39 | v38.15,37.85 37.97,37.67 15.6,37.67 13.72,39.55 v11.56,39.55
  Bottom 0.254: v19.25,23.39 19.25,25.68 17.75,27.18 16.36,27.18 15.8,27.74 15.8,27.76 15.72,27.84 15.72,29.29 15.29,29.72 14.1,29.72 11.89,31.93 11.89,39.22 v11.56,39.55 | v38.15,37.85 38.15,47.88 J1.VCC5V@1
VIN  (via drill 0.3)
  Top 0.813: D6.C 25.9,40.88 v25.53,41.25
  Bottom 0.813: v25.53,41.25 25.53,46.94 U$9.VIN
VOUT
  Top 1.27: JP1.3 8.28,45.7 U$9.VOUT

### Text on the board
Unrouted: not ordered
tNames: JKW / v2